# Altium schematic sheet TM4C-A.SchDoc
size A4
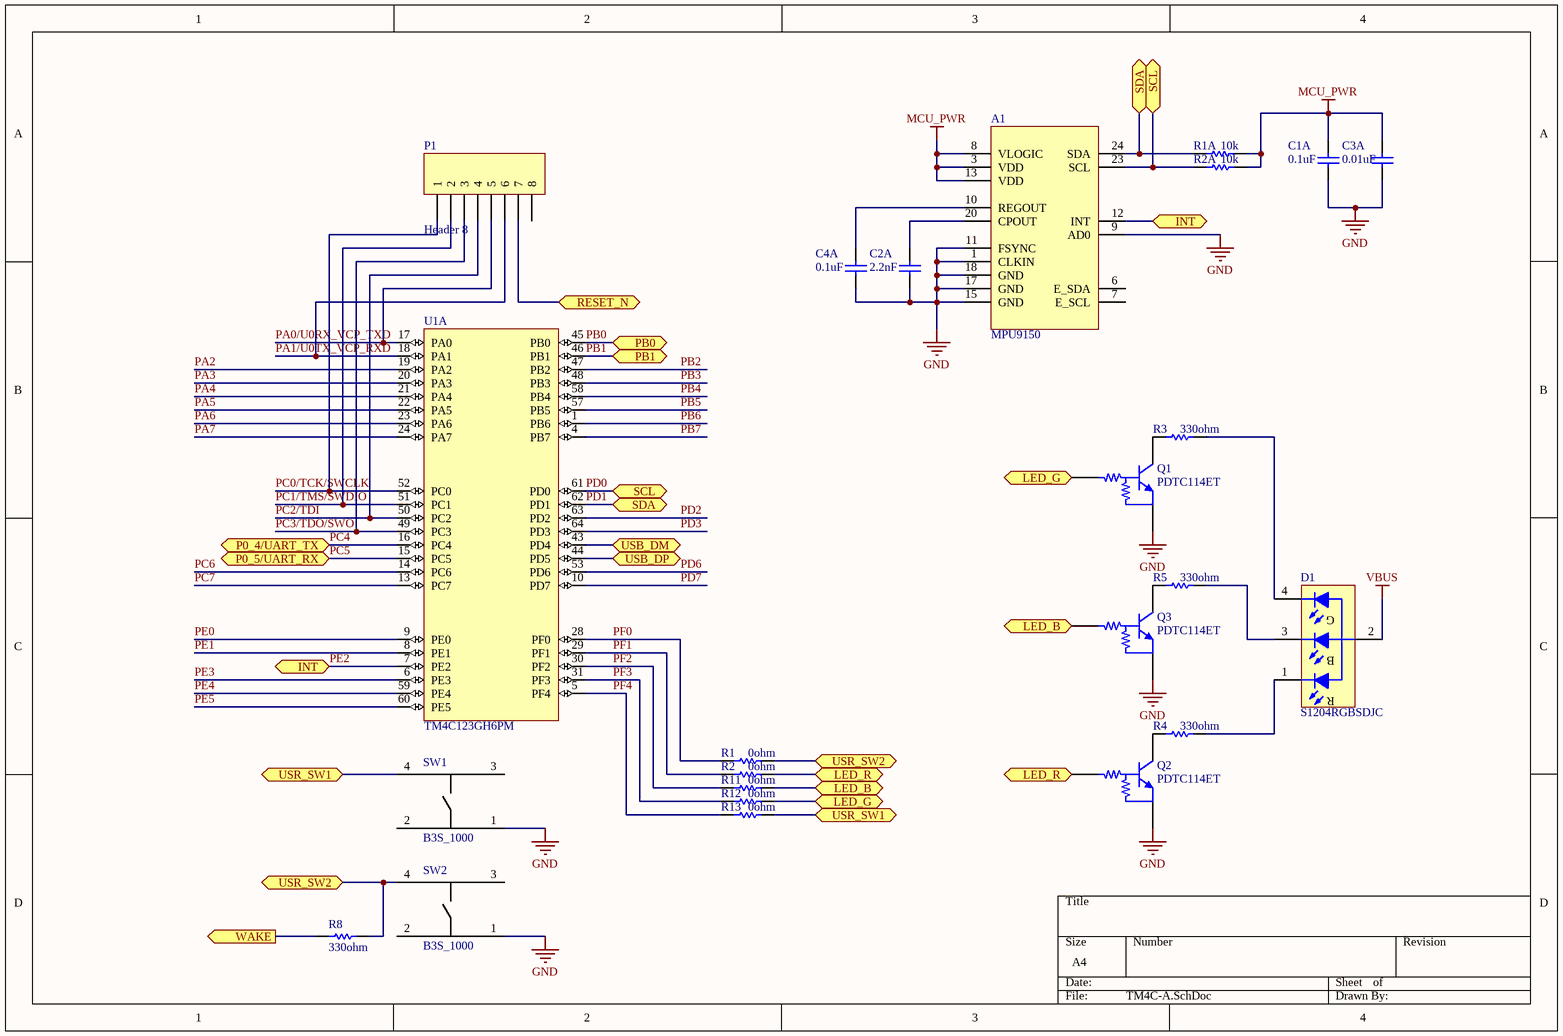
[diagram p0: TM4C-A.SchDoc]

## Parts
A1  MPU9150  [MPU9150]
C1A  0.1uF  [C0805]
C2A  2.2nF  [C0805]
C3A  0.01uF  [C0805]
C4A  0.1uF  [C0805]
D1  S1204RGBSDJC  [CLVBA-FKA]
P1  Header 8  [HDR1X8]
Q1  PDTC114ET  [SOT23_N]
Q2  PDTC114ET  [SOT23_N]
Q3  PDTC114ET  [SOT23_N]
R1  0ohm  [ERA-0805]
R1A  10k  [ERA-0805]
R2  0ohm  [ERA-0805]
R2A  10k  [ERA-0805]
R3  330ohm  [ERA-0805]
R4  330ohm  [ERA-0805]
R5  330ohm  [ERA-0805]
R8  330ohm  [ERA-0805]
R11  0ohm  [ERA-0805]
R12  0ohm  [ERA-0805]
R13  0ohm  [ERA-0805]
SW1  B3S_1000  [B3S_1000]
SW2  B3S_1000  [B3S_1000]
U1  TM4C123GH6PM  [LQFP64_L]  (part A of 2)

## Ports
INT (bidir), LED_B (bidir), LED_G (bidir), LED_R (bidir), P0_4/UART_TX (bidir), P0_5/UART_RX (bidir), PB0 (bidir), PB1 (bidir), RESET_N (bidir), SCL (bidir), SDA (bidir), USB_DM (bidir), USB_DP (bidir), USR_SW1 (bidir), USR_SW2 (bidir), WAKE (out)

## Nets
GND: A1.1(CLKIN) A1.9(AD0) A1.11(FSYNC) A1.15(GND) A1.17(GND) A1.18(GND) C1A.1 C2A.1 C3A.1 C4A.1 Q1.2(E) Q2.2(E) Q3.2(E) SW1.1 SW2.1
MCU_PWR: A1.3(VDD) A1.8(VLOGIC) A1.13(VDD) C1A.2 C3A.2 R1A.1 R2A.1
VBUS: D1.2(A2)
LED_B: Q3.1(B) R11.2 ; port LED_B
LED_G: Q1.1(B) R12.2 ; port LED_G
LED_R: Q2.1(B) R2.2 ; port LED_R
PA0/U0RX_VCP_TXD: P1.5 U1.17(PA0)
PA1/U0TX_VCP_RXD: P1.6 U1.18(PA1)
PA2: U1.19(PA2)
PA3: U1.20(PA3)
PA4: U1.21(PA4)
PA5: U1.22(PA5)
PA6: U1.23(PA6)
PA7: U1.24(PA7)
PB0: U1.45(PB0) ; port PB0
PB1: U1.46(PB1) ; port PB1
PB2: U1.47(PB2)
PB3: U1.48(PB3)
PB4: U1.58(PB4)
PB5: U1.57(PB5)
PB6: U1.1(PB6)
PB7: U1.4(PB7)
PC0/TCK/SWCLK: P1.1 U1.52(PC0)
PC1/TMS/SWDIO: P1.2 U1.51(PC1)
PC2/TDI: P1.4 U1.50(PC2)
PC3/TDO/SWO: P1.3 U1.49(PC3)
PC4: U1.16(PC4) ; port P0_4/UART_TX
PC5: U1.15(PC5) ; port P0_5/UART_RX
PC6: U1.14(PC6)
PC7: U1.13(PC7)
PD0: A1.23(SCL) R2A.2 U1.61(PD0) ; port SCL
PD1: A1.24(SDA) R1A.2 U1.62(PD1) ; port SDA
PD2: U1.63(PD2)
PD3: U1.64(PD3)
PD6: U1.53(PD6)
PD7: U1.10(PD7)
PE0: U1.9(PE0)
PE1: U1.8(PE1)
PE2: A1.12(INT) U1.7(PE2) ; port INT
PE3: U1.6(PE3)
PE4: U1.59(PE4)
PE5: U1.60(PE5)
PF0: R1.1 U1.28(PF0)
PF1: R2.1 U1.29(PF1)
PF2: R11.1 U1.30(PF2)
PF3: R12.1 U1.31(PF3)
PF4: R13.1 U1.5(PF4)
RESET_N: P1.7 ; port RESET_N
USB_DM: U1.43(PD4) ; port USB_DM
USB_DP: U1.44(PD5) ; port USB_DP
USR_SW1: R13.2 SW1.4 ; port USR_SW1
USR_SW2: R1.2 R8.2 SW2.4 ; port USR_SW2
WAKE: R8.1 ; port WAKE
NetA1_10: A1.10(REGOUT) C4A.2
NetA1_20: A1.20(CPOUT) C2A.2
NetD1_1: D1.1(R) R4.1
NetD1_3: D1.3(B) R5.1
NetD1_4: D1.4(G) R3.1
NetQ1_3: Q1.3(C) R3.2
NetQ2_3: Q2.3(C) R4.2
NetQ3_3: Q3.3(C) R5.2

Not connected (* = marked no-connect by the designer): A1 6(E_SDA) 7(E_SCL); P1 8; SW1 2 3; SW2 2 3

## Library data of the parts
C1A C2A C3A C4A = Cap Semi: Capacitor (Semiconductor SIM Model); Published: 8-Jun-2000; LatestRevisionDate: 29-May-2009; LatestRevisionNote: IPC-7351 Footprint Added.; PackageReference: C1206; Publisher: Altium Limited; PackageDescription: Chip Capacitor
  C1A C4A: Value: 0.1uF
  C2A: Value: 2.2nF
  C3A: Value: 0.01uF
D1 = S1204RGBSDJC: Ultra-Bright RGB Tri-color LED Lamp, 4-Lead 1204-size SMD; Published: 14-Mar-2008; DatasheetVersion: Aug-2006; PackageVersion: Aug-2006; PackageReference: LED1204; Publisher: Altium Limited; PackageDescription: SM Tri-color LED Lamp, 4-Leads 1204-size; ComponentLink1Description: Manufacturer Link; ComponentLink1URL: http://www.sansentech.com/; ComponentLink2Description: Datasheet; ComponentLink2URL: http://www.sansentech.com/LED/S1204RGBSDJC.pdf
P1 = Header 8: Header, 8-Pin; LatestRevisionDate: 17-Jul-2002; LatestRevisionNote: Re-released for DXP Platform.; Publisher: Altium Limited
Q1-Q3 = PDTC114ET: NPN Resistor-equipped Transistor; Published: 17-Sep-2003; LatestRevisionDate: 12-Dec-2006; LatestRevisionNote: IPC-7351 Footprint Added.; DatasheetVersion: 15-Apr-1999; PackageVersion: May-1999; PackageReference: SOT23; Publisher: Altium Limited; PackageDescription: 3-Pin SOT-23 Package 0.95 mm Pitch, 2.3 mm Lead Span; ComponentLink1Description: Manufacturer Link; ComponentLink1URL: http://www.semiconductors.philips.com/; ComponentLink2Description: Datasheet; ComponentLink2URL: http://www.semiconductors.philips.com/acrobat/datasheets/PDTC114E_SERIES_10.pdf
R1 R1A R2 R2A R3-R5 R8 R11-R13 = ERAS: Metal Film Thermosensitive Chip Resistor, 0.56 Ohm to 10k Ohm Range, 5% Tolerance, 0805 Size, 0.1 W; Note: If flow soldering, adjust pad width of PCB Footprint to 0.7 - 0.8 times the width of the resistor.; Published: 17-Dec-2003; LatestRevisionDate: 19-Mar-2004; LatestRevisionNote: Silkscreen size reduced.; PackageReference: ERA-0805; Publisher: Altium Limited; PackageDocument: Mar-2003; Code_IPC: 2012 [0805]; ComponentLink1Description: Manufacturer Link; ComponentLink1URL: http://www.panasonic.com/industrial/components/resistive_products.htm; ComponentLink2Description: Datasheet; ComponentLink2URL: http://www.panasonic.com/industrial/components/pdf/AOF0000CE1.pdf